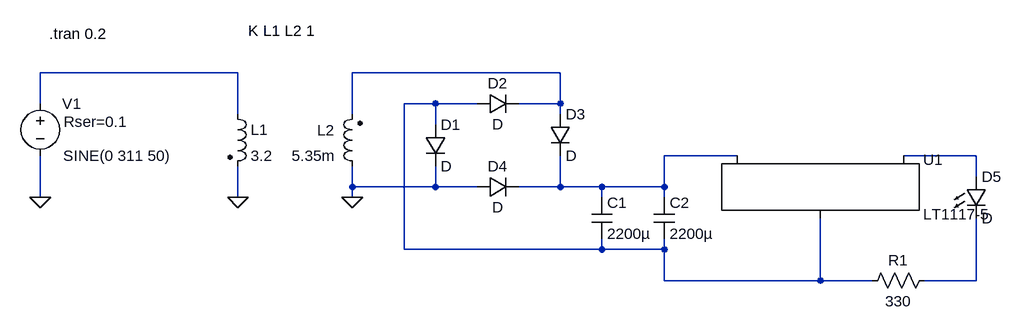
[diagram p0: schematic ac-dc-rectifier-circuit.asc]
ac-dc-rectifier-circuit.asc, the LTspice schematic file:
Version 4
SHEET 1 1564 680
WIRE 352 -112 48 -112
WIRE 848 -112 528 -112
WIRE 48 -64 48 -112
WIRE 656 -64 608 -64
WIRE 720 -64 656 -64
WIRE 848 -64 848 -112
WIRE 848 -64 784 -64
WIRE 352 -48 352 -112
WIRE 528 -48 528 -112
WIRE 848 -48 848 -64
WIRE 656 -32 656 -64
WIRE 1120 16 1008 16
WIRE 1488 16 1376 16
WIRE 1488 48 1488 16
WIRE 528 64 528 32
WIRE 656 64 656 32
WIRE 656 64 528 64
WIRE 720 64 656 64
WIRE 848 64 848 16
WIRE 848 64 784 64
WIRE 912 64 848 64
WIRE 1008 64 1008 16
WIRE 1008 64 912 64
WIRE 48 80 48 16
WIRE 352 80 352 32
WIRE 528 80 528 64
WIRE 912 80 912 64
WIRE 1008 80 1008 64
WIRE 608 160 608 -64
WIRE 912 160 912 144
WIRE 912 160 608 160
WIRE 1008 160 1008 144
WIRE 1008 160 912 160
WIRE 1008 208 1008 160
WIRE 1248 208 1248 112
WIRE 1248 208 1008 208
WIRE 1328 208 1248 208
WIRE 1488 208 1488 112
WIRE 1488 208 1408 208
FLAG 48 80 0
FLAG 352 80 0
FLAG 528 80 0
SYMBOL voltage 48 -80 R0
WINDOW 0 34 16 Left 2
WINDOW 3 35 96 Left 2
WINDOW 123 0 0 Left 0
WINDOW 39 36 44 Left 2
SYMATTR InstName V1
SYMATTR Value SINE(0 311 50)
SYMATTR SpiceLine Rser=0.1
SYMBOL ind2 336 -64 R0
SYMATTR InstName L1
SYMATTR Value 3.2
SYMATTR Type ind
SYMBOL ind2 544 48 R180
WINDOW 0 43 71 Left 2
WINDOW 3 42 32 Left 2
SYMATTR InstName L2
SYMATTR Value 5.35m
SYMATTR Type ind
SYMBOL diode 640 -32 R0
SYMATTR InstName D1
SYMBOL diode 720 -48 R270
WINDOW 0 32 32 VTop 2
WINDOW 3 0 32 VBottom 2
SYMATTR InstName D2
SYMBOL diode 832 -48 R0
SYMATTR InstName D3
SYMBOL diode 720 80 R270
WINDOW 0 32 32 VTop 2
WINDOW 3 0 32 VBottom 2
SYMATTR InstName D4
SYMBOL cap 896 80 R0
SYMATTR InstName C1
SYMATTR Value 2200µ
SYMBOL cap 992 80 R0
SYMATTR InstName C2
SYMATTR Value 2200µ
SYMBOL PowerProducts\\LT1117-5 1248 16 R0
SYMATTR InstName U1
SYMBOL LED 1472 48 R0
SYMATTR InstName D5
SYMBOL res 1424 192 R90
WINDOW 0 0 56 VBottom 2
WINDOW 3 32 56 VTop 2
SYMATTR InstName R1
SYMATTR Value 330
TEXT 62 -172 Left 2 !.tran 0.2
TEXT 368 -176 Left 2 !K L1 L2 1

The netlist it stands for:
* ac-dc-rectifier-circuit.asc
V1 N001 0 SINE(0 311 50) Rser=0.1
L1 N001 0 3.2
L2 0 N002 5.35m
D1 N003 0 D
D2 N003 N002 D
D3 N002 N004 D
D4 0 N004 D
C1 N004 N003 2200µ
C2 N004 N003 2200µ
XU1 N003 N005 N004 LT1117-5
D5 N005 N006 D
R1 N006 N003 330
.model D D
.lib standard.dio
.tran 0.2
K L1 L2 1
.backanno
.end